# Altium schematic sheet Bat_Protection.SchDoc
size A4
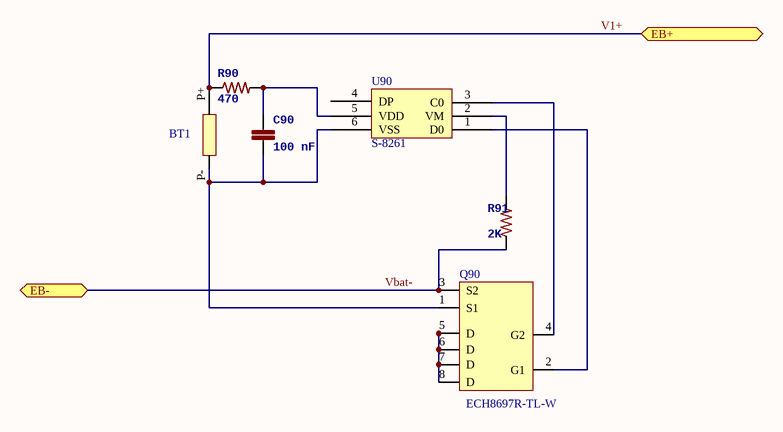
[diagram p0: Bat_Protection.SchDoc]

## Parts
BT1  Battery  [Battery-Li-ion]  (value not drawn)
C90  100 nF  [0805]
Q90  ECH8697R-TL-W  [SOT-28FL/ECH8]
R90  470  [0805]
R91  2K  [0805]
U90  S-8261  [SOT236-A-PKG]

## Ports
EB+, EB-

## Nets
V1+: BT1.P+ R90.1 ; port EB+
Vbat-: Q90.3(S2) R91.1 ; port EB-
NetBT1_P-: BT1.P- C90.2 Q90.1(S1) U90.6(VSS)
NetC90_1: C90.1 R90.2 U90.5(VDD)
NetQ90_2: Q90.2(G1) U90.1(D0)
NetQ90_4: Q90.4(G2) U90.3(C0)
NetQ90_5: Q90.5(D) Q90.6(D) Q90.7(D) Q90.8(D)
NetR91_2: R91.2 U90.2(VM)

Not connected (* = marked no-connect by the designer): U90 4(DP)

## Library data of the parts
C90 = CAP0805_100nF: Manufacturer: Kemet; Manufacturer Part Number: C0805C105K8RACTU; Tolerance: ±10%; Voltage - Rated: 10V; Temperature Coefficient: X7R; RoHS: RoHS Compliant; Category: Capacitors; Packaging: Tape & Reel (TR); Mounting Type: Surface Mount, MLCC; Operating Temperature: -55°C ~ 125°C; Applications: General Purpose; Ratings: -; Package / Case: 0805 (2012 Metric); Size / Dimension: 0.079" L x 0.049" W (2.00mm x 1.25mm); Height - Seated (Max): -; Thickness (Max): 0.039" (1.00mm); Lead Spacing: -; Features: -; Lead Style: -; ComponentLink1URL: http://www.kemet.com/docfinder?Partnumber=C0805C105K8RACTU; ComponentLink1Description: http://www.kemet.com/docfinder?Partnumber=C0805C105K8RACTU; Value: 100 nF; Supplier 1: Digi-Key; Supplier Part Number 1: 445-7534-1-ND
R90 = RES_0805_470: Manufacturer: TE Connectivity; Manufacturer Part Number: 1625856-2; Resistance (Ohms): 100M; Tolerance: ±10%; Power (Watts): 0.125W, 1/8W; Temperature Coefficient: ±100ppm/°C; RoHS: RoHS Compliant; Category: Resistors; Packaging: Cut Tape (CT); Composition: Thick Film; Features: -; Operating Temperature: -55°C ~ 125°C; Package / Case: 0805 (2012 Metric); Supplier Device Package: 0805; Size / Dimension: 0.079" L x 0.047" W (2.00mm x 1.20mm); Height: 0.020" (0.50mm); Number of Terminations: 2; ComponentLink1URL: http://www.te.com/commerce/DocumentDelivery/DDEController?Action=srchrtrv&DocNm=1625856&DocType=Customer+Drawing&DocLang=English; ComponentLink1Description: http://www.te.com/commerce/DocumentDelivery/DDEController?Action=srchrtrv&DocNm=1625856&DocType=Customer+Drawing&DocLang=English; Value: 470; Supplier 1: Digi-Key; Supplier Part Number 1: 311-470CRCT-ND
R91 = RES_0805_2K: Manufacturer: TE Connectivity; Manufacturer Part Number: 1625856-2; Resistance (Ohms): 100M; Tolerance: ±10%; Power (Watts): 0.125W, 1/8W; Temperature Coefficient: ±100ppm/°C; RoHS: RoHS Compliant; Category: Resistors; Packaging: Cut Tape (CT); Composition: Thick Film; Features: -; Operating Temperature: -55°C ~ 125°C; Package / Case: 0805 (2012 Metric); Supplier Device Package: 0805; Size / Dimension: 0.079" L x 0.047" W (2.00mm x 1.20mm); Height: 0.020" (0.50mm); Number of Terminations: 2; ComponentLink1URL: http://www.te.com/commerce/DocumentDelivery/DDEController?Action=srchrtrv&DocNm=1625856&DocType=Customer+Drawing&DocLang=English; ComponentLink1Description: http://www.te.com/commerce/DocumentDelivery/DDEController?Action=srchrtrv&DocNm=1625856&DocType=Customer+Drawing&DocLang=English; Value: 2K; Supplier 1: Digi-Key; Supplier Part Number 1: P2.00KCCT-ND
Q90 = ECH8697R-TL-W: Supplier 1: Digi-Key; Supplier Part Number 1: ECH8697R-TL-WOSCT-ND; Manuf Part No: ECH8697R-TL-W
U90 = S-8261: Supplier 1: Digi-Key; Supplier Part Number 1: 728-1034-1-ND